# EAGLE design Button Board (EAGLE 7.7.0)
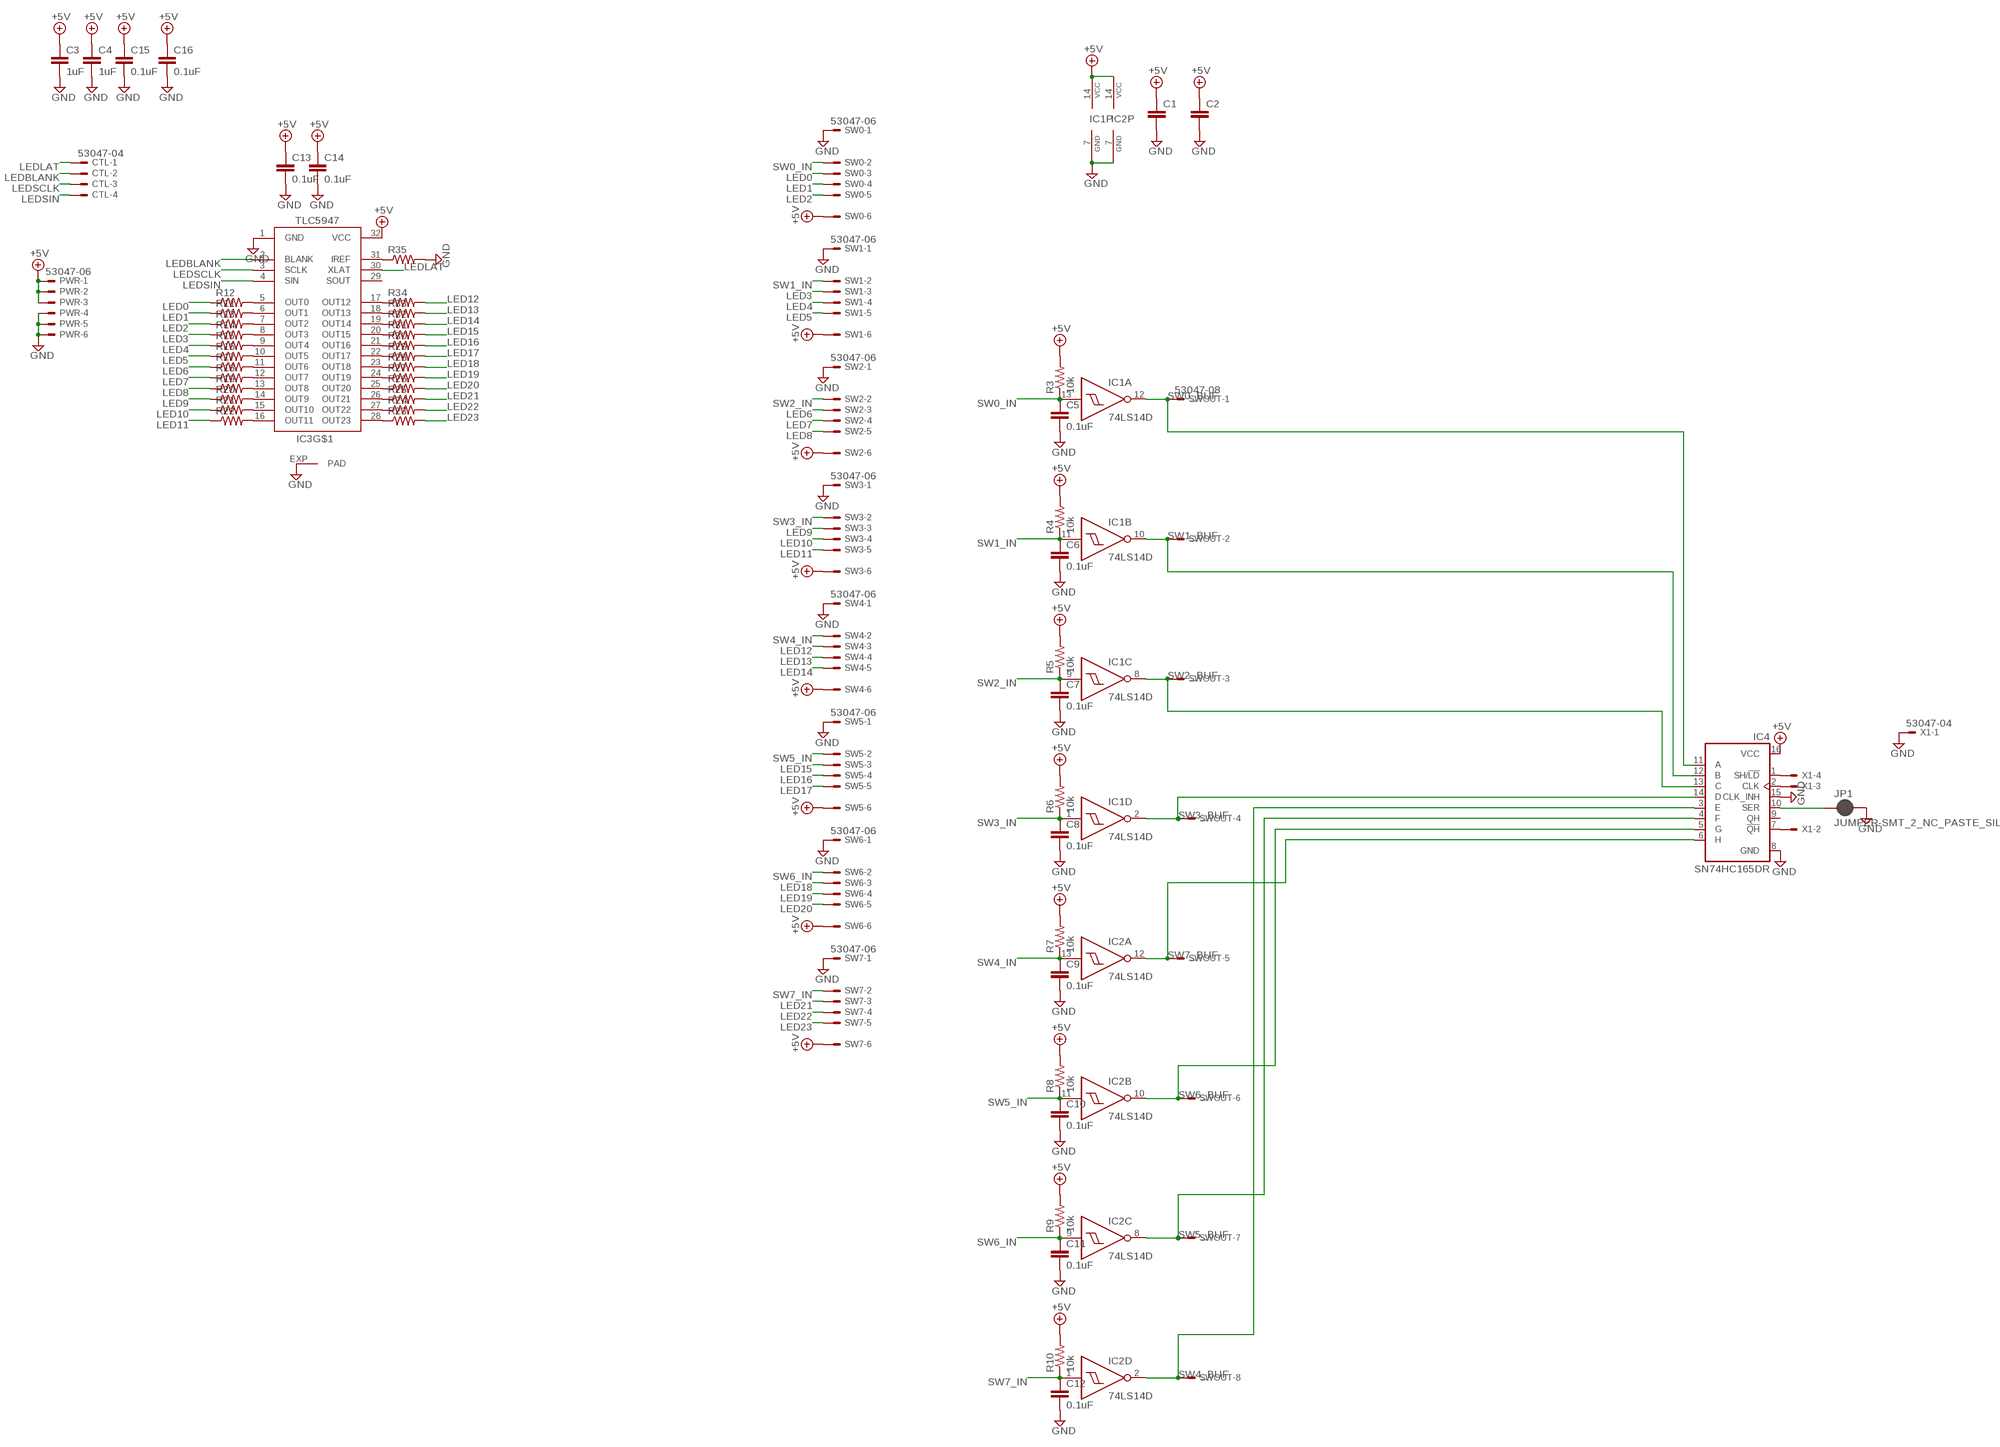
[diagram p0: schematic, sheet 1]

## Parts
C1  C-EUC1206  [C1206]
C2  C-EUC1206  [C1206]
C3  1uF  C-EUC1206K  [C1206K]
C4  1uF  C-EUC1206K  [C1206K]
C5  0.1uF  C-EUC1206  [C1206]
C6  0.1uF  C-EUC1206  [C1206]
C7  0.1uF  C-EUC1206  [C1206]
C8  0.1uF  C-EUC1206  [C1206]
C9  0.1uF  C-EUC1206  [C1206]
C10  0.1uF  C-EUC1206  [C1206]
C11  0.1uF  C-EUC1206  [C1206]
C12  0.1uF  C-EUC1206  [C1206]
C13  0.1uF  C-EUC1206  [C1206]
C14  0.1uF  C-EUC1206  [C1206]
C15  0.1uF  C-EUC1206K  [C1206K]
C16  0.1uF  C-EUC1206K  [C1206K]
CTL  53047-04  [53047-04]
IC1  74LS14D  [SO14]
IC2  74LS14D  [SO14]
IC3  TLC5947-DAP  [HTSSOP32DAP]
IC4  SN74HC165DR  74HC165D  [SO16]
JP1  JUMPER-SMT_2_NC_PASTE_SILK  [SMT-JUMPER_2_NC_PASTE_SILK]
PWR  53047-06  [53047-06]
R3  10k  R-US_M1206  [M1206]
R4  10k  R-US_M1206  [M1206]
R5  10k  R-US_M1206  [M1206]
R6  10k  R-US_M1206  [M1206]
R7  10k  R-US_M1206  [M1206]
R8  10k  R-US_M1206  [M1206]
R9  10k  R-US_M1206  [M1206]
R10  10k  R-US_M1206  [M1206]
R11  R-US_M1206  [M1206]
R12  R-US_M1206  [M1206]
R13  R-US_M1206  [M1206]
R14  R-US_M1206  [M1206]
R15  R-US_M1206  [M1206]
R16  R-US_M1206  [M1206]
R17  R-US_M1206  [M1206]
R18  R-US_M1206  [M1206]
R19  R-US_M1206  [M1206]
R20  R-US_M1206  [M1206]
R21  R-US_M1206  [M1206]
R22  R-US_M1206  [M1206]
R23  R-US_M1206  [M1206]
R24  R-US_M1206  [M1206]
R25  R-US_M1206  [M1206]
R26  R-US_M1206  [M1206]
R27  R-US_M1206  [M1206]
R28  R-US_M1206  [M1206]
R29  R-US_M1206  [M1206]
R30  R-US_M1206  [M1206]
R31  R-US_M1206  [M1206]
R32  R-US_M1206  [M1206]
R33  R-US_M1206  [M1206]
R34  R-US_M1206  [M1206]
R35  R-US_M1206  [M1206]
SW0  53047-06  [53047-06]
SW1  53047-06  [53047-06]
SW2  53047-06  [53047-06]
SW3  53047-06  [53047-06]
SW4  53047-06  [53047-06]
SW5  53047-06  [53047-06]
SW6  53047-06  [53047-06]
SW7  53047-06  [53047-06]
SWOUT  53047-08  [53047-08]
X1  53047-04  [53047-04]

## Nets
+5V: C1.1 C2.1 C3.1 C4.1 C13.1 C14.1 C15.1 C16.1 IC1.14(P:VCC) IC2.14(P:VCC) IC3.32(VCC) IC4.16(VCC) PWR.1 PWR.2 PWR.3 R3.2 R4.2 R5.2 R6.2 R7.2 R8.2 R9.2 R10.2 SW0.6 SW1.6 SW2.6 SW3.6 SW4.6 SW5.6 SW6.6 SW7.6
GND: C1.2 C2.2 C3.2 C4.2 C5.2 C6.2 C7.2 C8.2 C9.2 C10.2 C11.2 C12.2 C13.2 C14.2 C15.2 C16.2 IC1.7(P:GND) IC2.7(P:GND) IC3.1(GND) IC3.EXP(PAD) IC4.8(GND) IC4.15(CLK_INH) JP1.2 PWR.4 PWR.5 PWR.6 R35.2 SW0.1 SW1.1 SW2.1 SW3.1 SW4.1 SW5.1 SW6.1 SW7.1 X1.1
LED0: R12.1 SW0.3
LED1: R11.1 SW0.4
LED2: R13.1 SW0.5
LED3: R14.1 SW1.3
LED4: R15.1 SW1.4
LED5: R16.1 SW1.5
LED6: R17.1 SW2.3
LED7: R18.1 SW2.4
LED8: R19.1 SW2.5
LED9: R20.1 SW3.3
LED10: R21.1 SW3.4
LED11: R22.1 SW3.5
LED12: R34.2 SW4.3
LED13: R33.2 SW4.4
LED14: R32.2 SW4.5
LED15: R31.2 SW5.3
LED16: R30.2 SW5.4
LED17: R29.2 SW5.5
LED18: R28.2 SW6.3
LED19: R27.2 SW6.4
LED20: R26.2 SW6.5
LED21: R25.2 SW7.3
LED22: R24.2 SW7.4
LED23: R23.2 SW7.5
LEDBLANK: CTL.2 IC3.2(BLANK)
LEDLAT: CTL.1 IC3.30(XLAT)
LEDSCLK: CTL.3 IC3.3(SCLK)
LEDSIN: CTL.4 IC3.4(SIN)
N$1: IC4.1(SH/!LD) X1.4
N$2: IC4.2(CLK) X1.3
N$3: IC3.5(OUT0) R12.2
N$4: IC3.6(OUT1) R11.2
N$5: IC3.7(OUT2) R13.2
N$6: IC3.8(OUT3) R14.2
N$7: IC3.9(OUT4) R15.2
N$8: IC3.11(OUT6) R17.2
N$9: IC3.12(OUT7) R18.2
N$10: IC3.13(OUT8) R19.2
N$11: IC3.15(OUT10) R21.2
N$12: IC3.16(OUT11) R22.2
N$13: IC3.28(OUT23) R23.1
N$14: IC3.27(OUT22) R24.1
N$15: IC3.26(OUT21) R25.1
N$16: IC3.25(OUT20) R26.1
N$17: IC3.24(OUT19) R27.1
N$18: IC3.23(OUT18) R28.1
N$19: IC3.22(OUT17) R29.1
N$20: IC3.21(OUT16) R30.1
N$21: IC3.20(OUT15) R31.1
N$22: IC3.19(OUT14) R32.1
N$23: IC3.18(OUT13) R33.1
N$24: IC3.17(OUT12) R34.1
N$25: IC3.10(OUT5) R16.2
N$26: IC3.14(OUT9) R20.2
N$27: IC3.31(IREF) R35.1
N$28: IC4.7(!QH) X1.2
N$30: IC4.10(SER) JP1.1
SW0_BUF: IC1.12(A:O) IC4.11(A) SWOUT.1
SW0_IN: C5.1 IC1.13(A:I) R3.1 SW0.2
SW1_BUF: IC1.10(B:O) IC4.12(B) SWOUT.2
SW1_IN: C6.1 IC1.11(B:I) R4.1 SW1.2
SW2_BUF: IC1.8(C:O) IC4.13(C) SWOUT.3
SW2_IN: C7.1 IC1.9(C:I) R5.1 SW2.2
SW3_BUF: IC1.2(D:O) IC4.14(D) SWOUT.4
SW3_IN: C8.1 IC1.1(D:I) R6.1 SW3.2
SW4_BUF: IC2.2(D:O) IC4.3(E) SWOUT.8
SW4_IN: C9.1 IC2.13(A:I) R7.1 SW4.2
SW5_BUF: IC2.8(C:O) IC4.4(F) SWOUT.7
SW5_IN: C10.1 IC2.11(B:I) R8.1 SW5.2
SW6_BUF: IC2.10(B:O) IC4.5(G) SWOUT.6
SW6_IN: C11.1 IC2.9(C:I) R9.1 SW6.2
SW7_BUF: IC2.12(A:O) IC4.6(H) SWOUT.5
SW7_IN: C12.1 IC2.1(D:I) R10.1 SW7.2
Unconnected: IC1.3(E:I) IC1.4(E:O) IC1.5(F:I) IC1.6(F:O) IC2.3(E:I) IC2.4(E:O) IC2.5(F:I) IC2.6(F:O) IC3.29(SOUT) IC4.9(QH)

## Library data of the parts
C1-C16 = resistor:C-EU: CAPACITOR, European symbol
CTL X1 = con-molex:53?-04: CONNECTOR wire to board 1.25 mm (.049 inch) pitch header; MF: WALDOM/MOLEX; MPN: 53047-0410; OC_FARNELL: 9733060; OC_NEWARK: 38C9900
IC1 IC2 = 74xx-us:74*14: Hex schmitt trigger INVERTER
IC3 = adafruit:TLC5947
IC4 = SparkFun-IC-Logic:74*165: 8-Bit Shift Register (Parallel to Serial) Datasheet <https://cdn.sparkfun.com/datasheets/BreakoutBoards/sn54hc165.pdf> SparkFun Products SparkFun Shift-In Breakout - SN74HC165 <https://www.sparkfun.com/products/11733> (BOB-11733); PROD_ID: IC-11325
JP1 = SparkFun-Jumpers:JUMPER-SMT_2_NC_PASTE: Normally closed solder jumper This jumper has an aperture in the stencil to allow solder paste to bridge the split in the wire so it's normally closed (NC). Wick off the solder to open the connection. Reapply solder to reclose the connection.
PWR SW0 SW1-SW7 = con-molex:53?-06: CONNECTOR wire to board 1.25 mm (.049 inch) pitch header; MPN: 53047-0610-C; OC_FARNELL: 9733078; OC_NEWARK: 03M2965
R3-R35 = resistor:R-US_: RESISTOR, American symbol
SWOUT = con-molex:53?-08: CONNECTOR wire to board 1.25 mm (.049 inch) pitch header; MPN: 53047-0810; OC_FARNELL: 1012258; OC_NEWARK: 98K9826

## Board
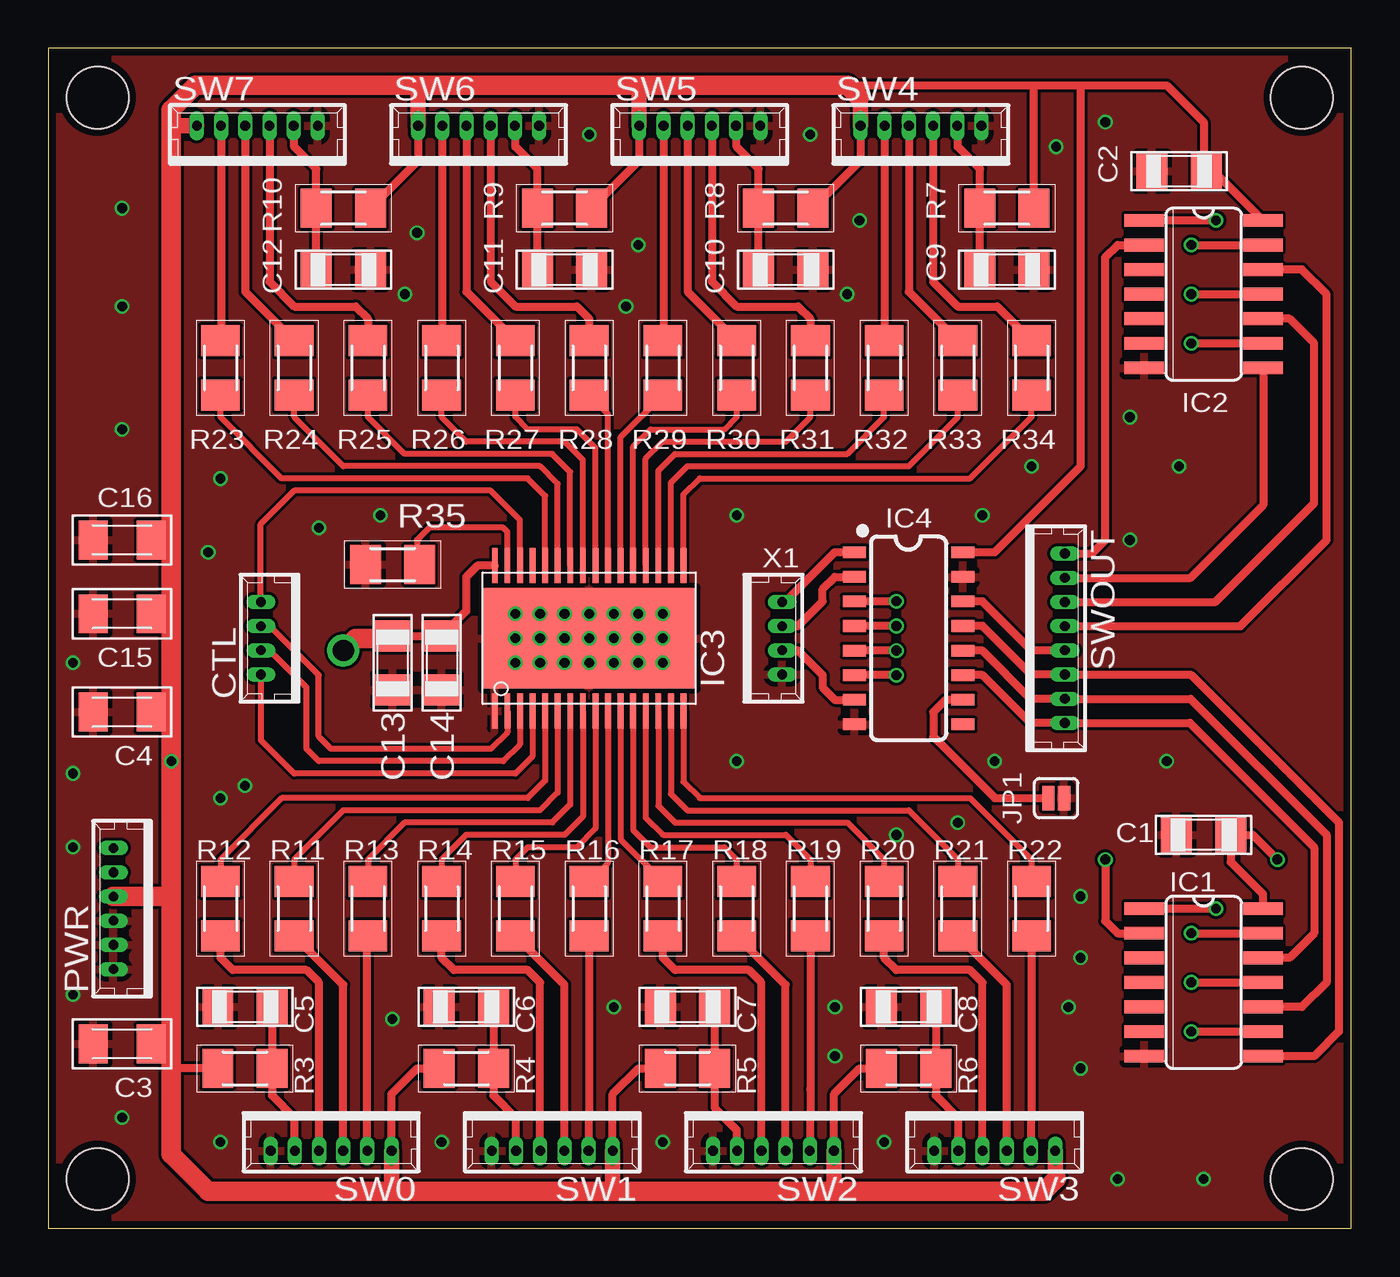
[diagram p1: board, top side]
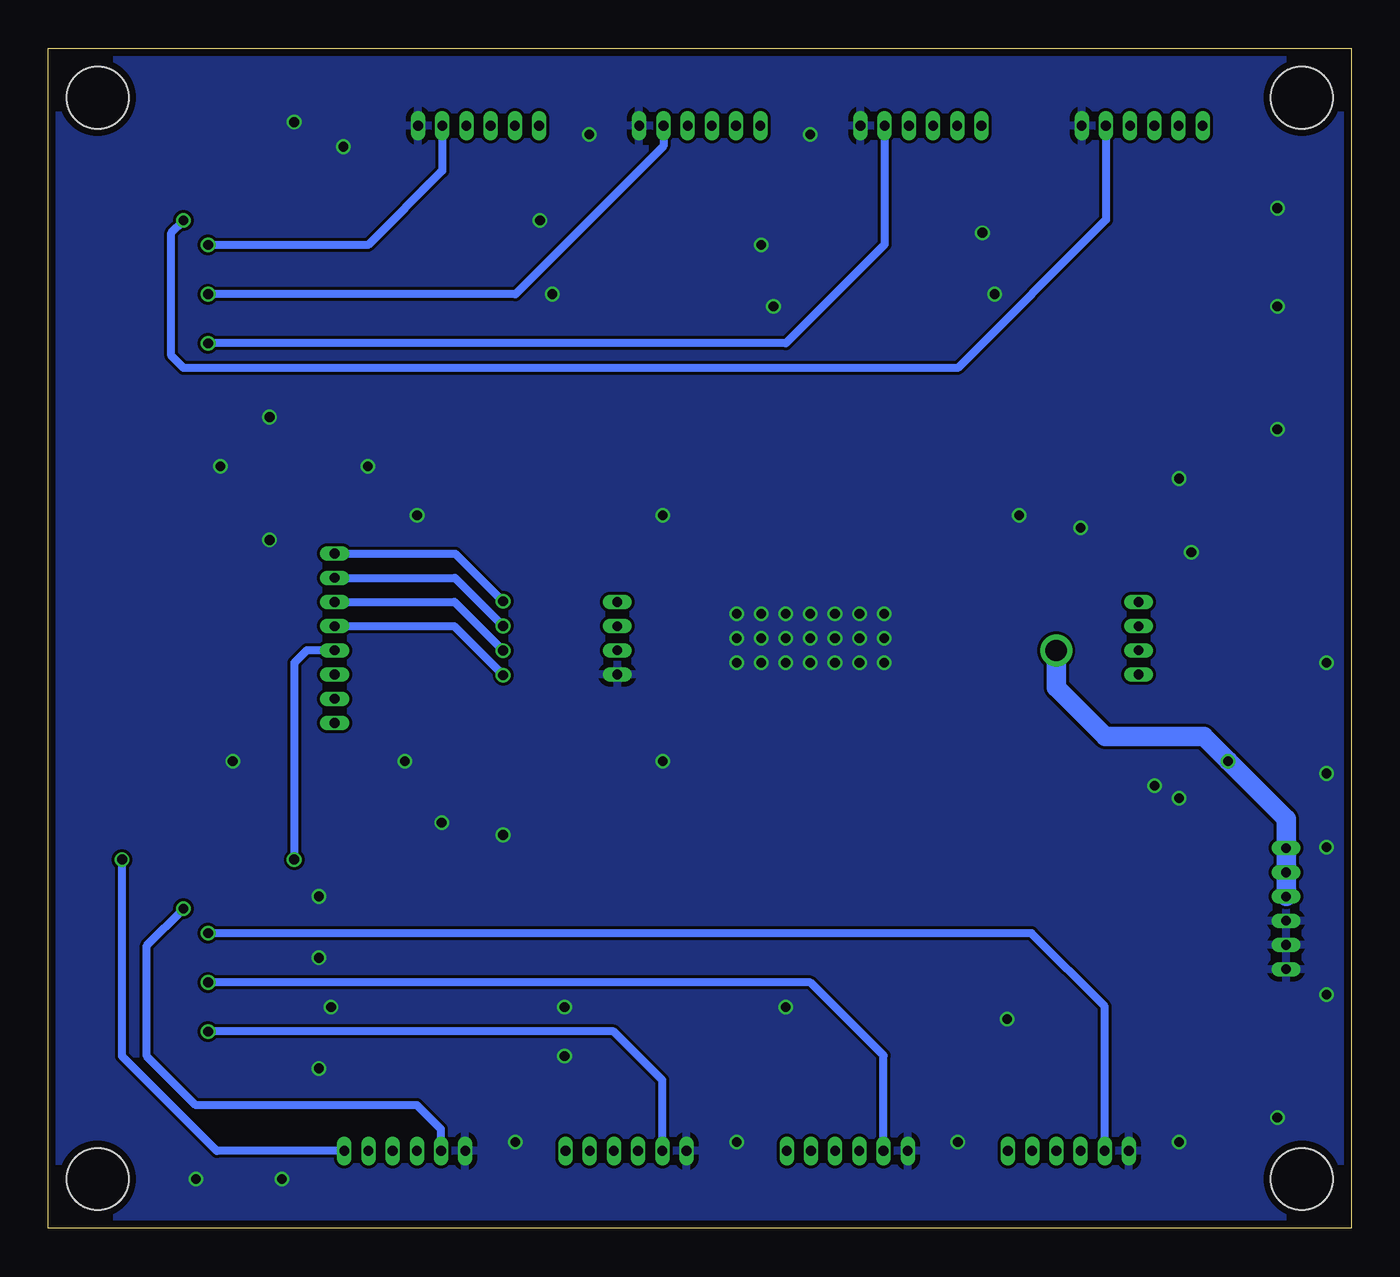
[diagram p2: board, bottom side, seen from below]

Size 67.31 x 60.96 mm. Coordinates in mm from the lower left corner, seen from the top.
Outline: 0,0 67.31,0 67.31,60.96 0,60.96 0,0
Copper layers (1*16): Top 0.035559375mm / dielectric 1.6mm / Bottom 0.035559375mm
Design rules "oshpark-2layer": minimum track width 6mil, minimum drill 10mil, track to track 6mil, track to pad 6mil, pad to pad 6mil, via to via 6mil, smd to smd 6mil, copper to edge 15mil, drill to drill 6mil, minimum pad ring 5mil, minimum via ring 5mil, stop-mask expansion 2.5mil, vias tented up to drill 0mil, thermal gap 10mil
Holes 3.2 mm at 2.54,2.54 2.54,58.42 64.77,58.42 64.77,2.54

### Footprints (pad centres in the part's own frame; a part is rotated, then mirrored left to right if it is on the bottom)
C1206 = smd 1.6 x 1.8: 1 -1.4,0; 2 1.4,0
C1206K = smd 1.5 x 2: 1 -1.5,0; 2 1.5,0
53047-04 = drill 0.5 pad 0.698 long: 1 1.875,0.45; 2 0.625,0.45; 3 -0.625,0.45; 4 -1.875,0.45
SO14 = smd 0.66 x 2.032: 1 -3.81,-3.073; 2 -2.54,-3.073; 3 -1.27,-3.073; 4 0,-3.073; 5 1.27,-3.073; 6 2.54,-3.073; 7 3.81,-3.073; 8 3.81,3.073; 9 2.54,3.073; 10 1.27,3.073; 11 0,3.073; 12 -1.27,3.073; 13 -2.54,3.073; 14 -3.81,3.073
HTSSOP32DAP = smd 0.3 x 1.8: 1 -4.875,-3.75; 2 -4.225,-3.75; 3 -3.575,-3.75; 4 -2.925,-3.75; 5 -2.275,-3.75; 6 -1.625,-3.75; 7 -0.975,-3.75; 8 -0.325,-3.75; 9 0.325,-3.75; 10 0.975,-3.75; 11 1.625,-3.75; 12 2.275,-3.75; 13 2.925,-3.75; 14 3.575,-3.75; 15 4.225,-3.75; 16 4.875,-3.75; 17 4.875,3.75; 18 4.225,3.75; 19 3.575,3.75; 20 2.925,3.75; 21 2.275,3.75; 22 1.625,3.75; 23 0.975,3.75; 24 0.325,3.75; 25 -0.325,3.75; 26 -0.975,3.75; 27 -1.625,3.75; 28 -2.275,3.75; 29 -2.925,3.75; 30 -3.575,3.75; 31 -4.225,3.75; 32 -4.875,3.75 | smd 11 x 5.2: EXP 0,0
SO16 = smd 0.6 x 1.2: 1 -4.445,-2.8; 2 -3.175,-2.8; 3 -1.905,-2.8; 4 -0.635,-2.8; 5 0.635,-2.8; 6 1.905,-2.8; 7 3.175,-2.8; 8 4.445,-2.8; 9 4.445,2.8; 10 3.175,2.8; 11 1.905,2.8; 12 0.635,2.8; 13 -0.635,2.8; 14 -1.905,2.8; 15 -3.175,2.8; 16 -4.445,2.8
SMT-JUMPER_2_NC_PASTE_SILK = smd 0.635 x 1.27: 1 -0.406,0; 2 0.406,0
53047-06 = drill 0.5 pad 0.698 long: 1 3.125,0.45; 2 1.875,0.45; 3 0.625,0.45; 4 -0.625,0.45; 5 -1.875,0.45; 6 -3.125,0.45
M1206 = smd 1.6 x 2: 1 -1.4,0; 2 1.4,0
53047-08 = drill 0.5 pad 0.698 long: 1 4.375,0.45; 2 3.125,0.45; 3 1.875,0.45; 4 0.625,0.45; 5 -0.625,0.45; 6 -1.875,0.45; 7 -3.125,0.45; 8 -4.375,0.45

### Placement (x,y rotation side)
C1  59.69,20.32 180 top
C2  58.42,54.61 180 top
C3  3.81,9.53 180 top
C4  3.81,26.67 180 top
C5  10.16,11.43 180 top
C6  21.59,11.43 180 top
C7  33.02,11.43 180 top
C8  44.45,11.43 180 top
C9  49.53,49.53 0 top
C10  38.1,49.53 0 top
C11  26.67,49.53 0 top
C12  15.24,49.53 0 top
C13  17.78,29.21 270 top
C14  20.32,29.21 270 top
C15  3.81,31.75 180 top
C16  3.81,35.56 180 top
CTL  11.43,30.48 90 top
IC1  59.69,12.7 270 top
IC2  59.69,48.26 270 top
IC3  27.94,30.48 0 top
IC4  44.45,30.48 270 top
JP1  52.07,22.23 0 top
PWR  3.81,16.51 90 top
R3  10.16,8.26 180 top
R4  21.59,8.26 180 top
R5  33.02,8.26 180 top
R6  44.45,8.26 180 top
R7  49.53,52.7 0 top
R8  38.1,52.7 0 top
R9  26.67,52.7 0 top
R10  15.24,52.7 0 top
R11  12.7,16.51 90 top
R12  8.89,16.51 90 top
R13  16.51,16.51 90 top
R14  20.32,16.51 90 top
R15  24.13,16.51 90 top
R16  27.94,16.51 90 top
R17  31.75,16.51 90 top
R18  35.56,16.51 90 top
R19  39.37,16.51 90 top
R20  43.18,16.51 90 top
R21  46.99,16.51 90 top
R22  50.8,16.51 90 top
R23  8.89,44.45 90 top
R24  12.7,44.45 90 top
R25  16.51,44.45 90 top
R26  20.32,44.45 90 top
R27  24.13,44.45 90 top
R28  27.94,44.45 90 top
R29  31.75,44.45 90 top
R30  35.56,44.45 90 top
R31  39.37,44.45 90 top
R32  43.18,44.45 90 top
R33  46.99,44.45 90 top
R34  50.8,44.45 90 top
R35  17.78,34.29 180 top
SW0  14.61,4.45 180 top
SW1  26.04,4.45 180 top
SW2  37.47,4.45 180 top
SW3  48.9,4.45 180 top
SW4  45.09,56.52 0 top
SW5  33.66,56.52 0 top
SW6  22.23,56.52 0 top
SW7  10.79,56.52 0 top
SWOUT  52.07,30.48 270 top
X1  37.47,30.48 270 top

### Tracks (layer width: path | path; a pad name or v marks a point on that pad's centre or on a via)
+5V  (via drill 0.5, 1.1)
  Top 0.406: IC3.32 22.16,34.23 21.59,33.66 21.59,31.88 C14.1 C13.1 | SW0.6 17.73,6.93 19.05,8.26 R4.2 | SW1.6 29.16,6.93 30.48,8.26 R5.2 | SW2.6 40.59,6.93 41.91,8.26 R6.2 | R3.2 6.35,8.26 | v63.5,19.05 62.23,20.32 C1.1 61.09,18.92 62.76,17.25 IC1.14 | SW4.6 41.96,55.16 R8.2 | SW5.6 30.53,55.16 R9.2 | SW6.6 19.1,55.16 R10.2 | 41.27,59.05 50.8,59.05 | 50.8,59.05 53.34,59.05 | 53.34,59.05 57.78,59.05 59.69,57.15 59.69,54.74 C2.1 60.22,54.61 IC2.14 | R7.2 50.93,58.92 50.8,59.05 | IC4.16 48.9,34.92 53.34,39.37 53.34,59.05 | C16.1 6.35,35.56 | C15.1 6.35,31.75 | C4.1 6.35,26.67 | C3.1 5.71,9.53 6.35,8.89
  Top 0.813: SW3.6 52.02,2.59 52.07,2.54 | SW2.6 40.59,1.96 40.64,1.91 | SW1.6 29.16,1.96 29.21,1.91 | SW0.6 17.73,1.96 17.78,1.91 | SW4.6 41.96,58.37 41.91,58.42 | SW5.6 30.53,59.01 30.48,59.05 | SW6.6 19.1,59.01 19.05,59.05 | SW7.6 6.54,56.97 6.35,57.15
  Top 1.016: v15.24,29.84 15.88,30.48 17.65,30.48 C13.1 | PWR.3 5.72,17.14 6.35,17.14 | 6.35,17.14 6.35,8.89 6.35,8.26 6.35,3.81 8.26,1.91 17.78,1.91 29.21,1.91 40.64,1.91 51.44,1.91 52.07,2.54 | 6.35,17.14 v6.35,24.13 6.35,26.67 6.35,31.75 6.35,35.56 6.35,57.15 6.35,57.78 7.62,59.05 19.05,59.05 30.48,59.05 41.27,59.05 41.91,58.42
  Bottom 0.406: SW3.6 58.6,4 63.5,8.89 v63.5,19.05
  Bottom 1.016: PWR.3 PWR.2 PWR.1 3.36,21.14 v6.35,24.13 7.62,25.4 12.7,25.4 15.24,27.94 v15.24,29.84
GND  (via drill 0.5)
  other vias: 58.42,39.37 55.88,41.91 55.88,35.56 50.8,39.37 48.26,36.83 35.56,36.83 35.56,24.13 54.61,57.15 52.07,55.88 41.27,48.26 41.91,52.07 39.37,56.52 27.94,56.52 30.48,50.8 29.84,47.62 18.41,48.26 19.05,51.44 3.81,52.7 3.81,47.62 3.81,41.27 8.89,38.73 8.26,34.92 13.97,36.2 17.14,36.83 8.89,22.23 10.16,22.86 24.13,31.75 25.4,31.75 26.67,31.75 27.94,31.75 29.21,31.75 30.48,31.75 31.75,31.75 31.75,30.48 31.75,29.21 30.48,29.21 29.21,29.21 27.94,29.21 26.67,29.21 25.4,29.21 24.13,29.21 24.13,30.48 25.4,30.48 26.67,30.48 27.94,30.48 29.21,30.48 30.48,30.48 8.89,4.45 17.78,10.79 29.21,11.43 31.75,4.45 20.32,4.45 43.18,4.45 40.64,8.89 40.64,11.43 53.34,8.26 52.7,11.43 53.34,13.97 55.24,2.54 59.69,2.54 57.78,24.13 53.34,17.14 3.81,5.71 1.27,12.06 1.27,23.5 1.27,19.68 1.27,29.21 43.81,20.32 46.99,20.95 48.9,24.13
  pour Top: -7.62,67.31 76.2,67.31 76.2,-6.35 -7.62,-6.35
  pour Bottom: -11.43,71.12 83.82,71.12 83.82,-8.89 -11.43,-8.89
LED0
  Top 0.406: SW0.3 13.98,12.69 13.34,13.34 9.53,13.34 8.89,13.97 R12.1
LED1
  Top 0.406: SW0.4 15.23,12.58 R11.1
LED2
  Top 0.406: SW0.5 16.48,15.08 R13.1
LED3
  Top 0.406: SW1.3 25.41,12.69 24.77,13.34 20.95,13.34 20.32,13.97 R14.1
LED4
  Top 0.406: SW1.4 26.66,12.58 R15.1
LED5
  Top 0.406: R16.1 27.94,7.2 SW1.5
LED6
  Top 0.406: SW2.3 36.84,12.69 36.2,13.34 32.38,13.34 31.75,13.97 R17.1
LED7
  Top 0.406: SW2.4 38.09,12.58 R18.1
LED8
  Top 0.406: R19.1 39.37,7.2 SW2.5
LED9
  Top 0.406: SW3.3 48.27,12.69 47.62,13.34 43.81,13.34 43.18,13.97 R20.1
LED10
  Top 0.406: SW3.4 49.52,12.58 R21.1
LED11
  Top 0.406: R22.1 50.8,7.2 SW3.5
LED12
  Top 0.406: SW4.3 45.71,48.91 46.99,47.62 49.02,47.62 R34.2
LED13
  Top 0.406: SW4.4 44.46,48.38 R33.2
LED14
  Top 0.406: SW4.5 43.21,45.88 R32.2
LED15
  Top 0.406: SW5.3 34.28,48.91 35.56,47.62 38.73,47.62 39.37,46.99 R31.2
LED16
  Top 0.406: SW5.4 33.03,48.38 R30.2
LED17
  Top 0.406: SW5.5 31.78,45.88 R29.2
LED18
  Top 0.406: SW6.3 22.85,48.91 24.13,47.62 27.3,47.62 27.94,46.99 R28.2
LED19
  Top 0.406: SW6.4 21.6,48.38 R27.2
LED20
  Top 0.406: SW6.5 20.35,45.88 R26.2
LED21
  Top 0.406: SW7.3 11.42,48.91 12.7,47.62 15.88,47.62 16.51,46.99 R25.2
LED22
  Top 0.406: SW7.4 10.17,48.38 R24.2
LED23
  Top 0.406: SW7.5 8.92,45.88 R23.2
LEDBLANK
  Top 0.305: IC3.2 23.71,25.62 22.86,24.77 14.61,24.77 13.97,25.4 13.97,28.57 11.43,31.11 CTL.2
LEDLAT
  Top 0.305: IC3.30 24.36,36.59 22.86,38.1 12.7,38.1 10.98,36.38 CTL.1
LEDSCLK
  Top 0.305: IC3.3 24.36,25 23.5,24.13 13.97,24.13 13.34,24.77 13.34,27.94 11.43,29.84 10.99,29.84 CTL.3
LEDSIN
  Top 0.305: IC3.4 25.02,24.38 24.13,23.5 12.7,23.5 10.98,25.21 CTL.4
N$1
  Top 0.406: X1.4 38.07,32.35 40.64,34.92 IC4.1
N$2
  Top 0.406: X1.3 38.73,31.11 40.01,32.38 40.01,33.02 40.64,33.66 IC4.2
N$3
  Top 0.305: IC3.5 25.66,23.12 24.77,22.23 12.06,22.23 8.89,19.05 R12.2
N$4
  Top 0.305: IC3.6 26.32,22.5 25.4,21.59 15.24,21.59 12.7,19.05 R11.2
N$5
  Top 0.305: IC3.7 26.96,21.89 26.04,20.95 18.41,20.95 16.51,19.05 R13.2 16.51,17.78
N$6
  Top 0.305: IC3.8 27.61,21.27 26.67,20.32 21.59,20.32 20.32,19.05 R14.2
N$7
  Top 0.305: IC3.9 28.27,20.64 27.3,19.68 24.77,19.68 24.13,19.05 R15.2
N$8
  Top 0.305: IC3.11 29.57,20.09 R17.2
N$9
  Top 0.305: IC3.12 30.21,20.59 31.11,19.68 34.92,19.68 35.56,19.05 R18.2
N$10
  Top 0.305: IC3.13 30.86,21.2 31.75,20.32 38.1,20.32 39.37,19.05 R19.2
N$11
  Top 0.305: IC3.15 32.16,22.45 33.02,21.59 44.45,21.59 46.99,19.05 R21.2
N$12
  Top 0.305: IC3.16 32.81,23.07 33.66,22.23 47.62,22.23 50.8,19.05 R22.2
N$13
  Top 0.305: IC3.28 25.66,37.84 24.77,38.73 12.06,38.73 8.89,41.91 R23.1
N$14
  Top 0.305: IC3.27 26.32,38.45 25.4,39.37 15.24,39.37 12.7,41.91 R24.1
N$15
  Top 0.305: IC3.26 26.96,39.08 26.04,40.01 18.41,40.01 16.51,41.91 R25.1
N$16
  Top 0.305: IC3.25 27.61,39.7 26.67,40.64 21.59,40.64 20.32,41.91 R26.1
N$17
  Top 0.305: IC3.24 28.27,40.31 27.3,41.27 24.77,41.27 24.13,41.91 R27.1
N$18
  Top 0.305: IC3.23 28.91,42.08 R28.1
N$19
  Top 0.305: IC3.22 29.57,40.87 R29.1
N$20
  Top 0.305: IC3.21 30.21,40.38 31.11,41.27 34.92,41.27 35.56,41.91 R30.1
N$21
  Top 0.305: IC3.20 30.86,39.76 31.75,40.64 38.1,40.64 39.37,41.91 R31.1
N$22
  Top 0.305: IC3.19 31.52,39.13 32.38,40.01 41.27,40.01 43.18,41.91 R32.1
N$23
  Top 0.305: IC3.18 32.16,38.52 33.02,39.37 44.45,39.37 46.99,41.91 R33.1
N$24
  Top 0.305: IC3.17 32.81,37.9 33.66,38.73 47.62,38.73 50.8,41.91 R34.1
N$25
  Top 0.305: IC3.10 28.91,18.89 R16.2
N$26
  Top 0.305: IC3.14 31.52,21.82 32.38,20.95 41.27,20.95 43.18,19.05 R20.2
N$27
  Top 0.305: IC3.31 23.71,35.98 23.5,36.2 19.68,36.2 19.05,35.56 19.05,34.42 R35.1
N$28
  Top 0.406: X1.2 38.73,29.86 40.01,28.57 40.01,27.94 40.64,27.3 IC4.7
N$30
  Top 0.406: IC4.10 46.35,27.3 45.72,26.67 45.72,25.4 48.9,22.23 JP1.1
SW0_BUF
  Top 0.406: IC1.12 64.14,13.97 65.41,15.24 65.41,19.68 58.98,26.11 SWOUT.1 50.73,26.11 48.26,28.57 IC4.11
SW0_IN  (via drill 0.5)
  Top 0.406: C5.1 R3.1 11.56,6.86 12.7,5.71 12.7,4.03 SW0.2 | v59.05,15.24 IC1.13
  Bottom 0.406: SW0.2 12.73,11.46 16.51,15.24 v59.05,15.24
SW1_BUF
  Top 0.406: IC1.10 64.77,11.43 66.04,12.7 66.04,20.32 59.01,27.36 SWOUT.2 50.75,27.36 48.26,29.84 IC4.12
SW1_IN  (via drill 0.5)
  Top 0.406: C6.1 R4.1 22.99,6.86 24.13,5.71 24.13,4.03 SW1.2 | v59.05,12.7 IC1.11
  Bottom 0.406: SW1.2 24.16,8.92 27.94,12.7 v59.05,12.7
SW2_BUF
  Top 0.406: IC1.8 65.41,8.89 66.67,10.16 66.67,20.95 59.02,28.61 SWOUT.3 50.77,28.61 48.26,31.11 IC4.13
SW2_IN  (via drill 0.5)
  Top 0.406: C7.1 R5.1 34.42,6.22 35.56,5.08 35.56,4.03 SW2.2 | v59.05,10.16 IC1.9
  Bottom 0.406: SW2.2 35.59,7.65 38.1,10.16 v59.05,10.16
SW3_BUF  (via drill 0.5)
  Top 0.406: v54.61,19.05 54.61,15.88 55.24,15.24 IC1.2 | SWOUT.4 50.79,29.86 48.26,32.38 IC4.14
  Bottom 0.406: SWOUT.4 53.97,29.86 54.61,29.21 v54.61,19.05
SW3_IN  (via drill 0.5)
  Top 0.406: C8.1 R6.1 45.85,6.86 46.99,5.71 46.99,4.03 SW3.2 | v60.33,16.51 IC1.1
  Bottom 0.406: SW3.2 47.02,5.11 48.26,6.35 59.69,6.35 62.23,8.89 62.23,14.61 v60.33,16.51
SW4_BUF  (via drill 0.5)
  Top 0.406: SWOUT.8 53.91,34.85 54.61,35.56 54.61,50.16 55.24,50.8 IC2.2 | v43.81,32.38 IC4.3
  Bottom 0.406: SWOUT.8 46.28,34.85 v43.81,32.38
SW4_IN  (via drill 0.5)
  Top 0.406: C9.1 R7.1 48.13,54.74 46.99,55.88 46.99,56.94 SW4.2 | v59.05,50.8 IC2.13
  Bottom 0.406: SW4.2 46.96,54.64 50.8,50.8 v59.05,50.8
SW5_BUF  (via drill 0.5)
  Top 0.406: SWOUT.7 59.01,33.6 62.76,37.36 IC2.8 | v43.81,31.11 IC4.4
  Bottom 0.406: SWOUT.7 46.3,33.6 v43.81,31.11
SW5_IN  (via drill 0.5)
  Top 0.406: C10.1 R8.1 36.7,54.74 35.53,55.91 SW5.2 | v59.05,48.26 IC2.11
  Bottom 0.406: v59.05,48.26 43.18,48.26 35.53,55.91 SW5.2
SW6_BUF  (via drill 0.5)
  Top 0.406: SWOUT.6 60.3,32.35 65.41,37.47 65.41,45.72 64.14,46.99 IC2.10 | v43.81,29.84 IC4.5
  Bottom 0.406: SWOUT.6 46.33,32.35 v43.81,29.84
SW6_IN  (via drill 0.5)
  Top 0.406: C11.1 R9.1 25.27,54.74 24.13,55.88 24.13,56.94 SW6.2 | v59.05,45.72 IC2.9
  Bottom 0.406: SW6.2 24.1,50.83 29.21,45.72 v59.05,45.72
SW7_BUF  (via drill 0.5)
  Top 0.406: SWOUT.5 61.59,31.11 66.04,35.56 66.04,48.26 64.77,49.53 IC2.12 | v43.81,28.57 IC4.6
  Bottom 0.406: SWOUT.5 46.34,31.11 v43.81,28.57
SW7_IN  (via drill 0.5)
  Top 0.406: C12.1 R10.1 13.84,54.74 12.7,55.88 12.7,56.94 SW7.2 | v60.33,52.07 IC2.1
  Bottom 0.406: SW7.2 12.67,52.1 20.32,44.45 60.33,44.45 60.96,45.09 60.96,51.44 v60.33,52.07